# EAGLE design Stepper control circuit (EAGLE 7.6.0)
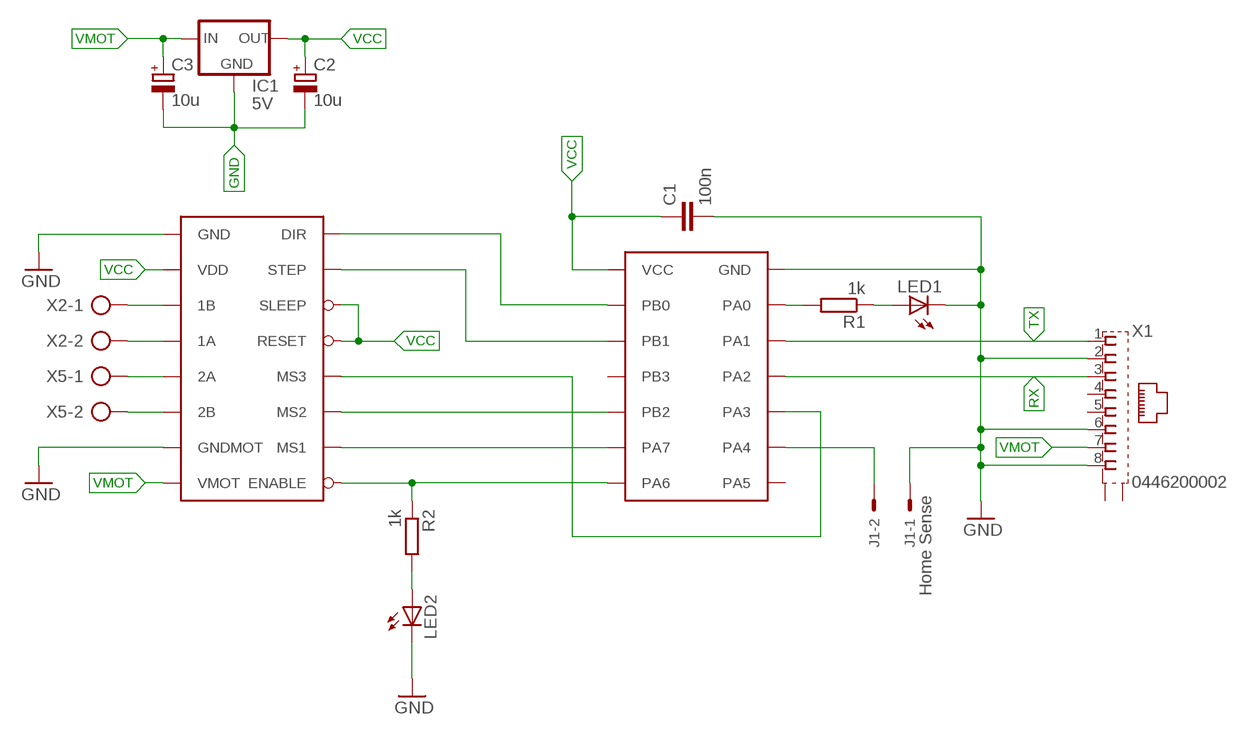
[diagram p0: schematic, sheet 1]

## Parts
C1  100n  C-EU050-025X075  [C050-025X075]
C2  10u  CPOL-EUE2.5-5  [E2,5-5]
C3  10u  CPOL-EUE2.5-5  [E2,5-5]
IC1  5V  VOL-REG-TO92  [TO92-CBE]
J1  Home Sense  22-27-2021-02  [6410-02]
LED1  LED3MM  [LED3MM]
LED2  LED3MM  [LED3MM]
R1  1k  R-EU_0204/2V  [0204V]
R2  1k  R-EU_0204/2V  [0204V]
U$1  ATTINY841-BOARD  [ADAPT-ATTINY841]
U$2  A4988-BOARD  [ADAPT-A4988]
X1  0446200002  [0446200002]
X2  AK500/2  [AK500/2]
X5  AK500/2  [AK500/2]

## Nets
DIR: U$1.PB0 U$2.DIR
ENABLE: R2.1 U$1.PA6 U$2.ENABLE
GND: C1.2 C2.- C3.- IC1.B(GND) J1.1 LED1.K(C) LED2.K(C) U$1.GND U$2.GND U$2.GNDMOT X1.2 X1.6 X1.8
MS1: U$1.PA7 U$2.MS1
MS2: U$1.PB2 U$2.MS2
MS3: U$1.PA3 U$2.MS3
N$1: J1.2 U$1.PA4
N$4: LED2.A R2.2
N$5: U$2.2B X5.2
N$6: U$2.2A X5.1
N$7: U$2.1A X2.2
N$8: R1.2 U$1.PA0
N$9: LED1.A R1.1
N$10: U$2.1B X2.1
RX: U$1.PA2 X1.3
STEP: U$1.PB1 U$2.STEP
TX: U$1.PA1 X1.1
VCC: C1.1 C2.+ IC1.C(OUT) U$1.VCC U$2.RESET U$2.SLEEP U$2.VDD
VMOT: C3.+ IC1.E(IN) U$2.VMOT X1.7
Unconnected: U$1.PA5 U$1.PB3 X1.4 X1.5 X1.S@1(S1) X1.S@2(S2)

## Library data of the parts
C1 = resistor:C-EU: CAPACITOR, European symbol
C2 C3 = resistor:CPOL-EU: POLARIZED CAPACITOR, European symbol
IC1 = LM78LXX-TO92-EBC:VOL-REG-TO92
J1 = con-molex:22-?-02: CONNECTOR wire to board 2.54 mm (.1 inch) pitch header; OC_FARNELL: unknown; OC_NEWARK: unknown
LED1 LED2 = led:LED: LED OSRAM: - CHIPLED LG R971, LG N971, LY N971, LG Q971, LY Q971, LO R971, LY R971 LH N974, LH R974 LS Q976, LO Q976, LY Q976 LO Q996 - Hyper CHIPLED LW Q18S LB Q993, LB Q99A, LB R99A - SideLED LS A670, LO A670, LY A670, LG A670, LP A670 LB A673, LV A673, LT A673, LW A673 LH A674 LY A675 LS A676, LA A676, LO A676, LY A676, LW A676 LS A679, LY A679, LG A679 - Hyper Micro SIDELED® LS Y876, LA Y876, LO Y876, LY Y876 LT Y87S - SmartLED LW L88C, LW L88S LB L89C, LB L89S, LG L890 LS L89K, LO L89K, LY L89K LS L896, LA L896, LO L896, LY L896 - TOPLED LS T670, LO T670, LY T670, LG T670, LP T670 LSG T670, LSP T670, LSY T670, LOP T670, LYG T670 LG T671, LOG T671, LSG T671 LB T673, LV T673, LT T673, LW T673 LH T674 LS T676, LA T676, LO T676, LY T676, LB T676, LH T676, LSB T676, LW T676 LB T67C, LV T67C, LT T67C, LS T67K, LO T67K, LY T67K, LW E67C LS E67B, LA E67B, LO E67B, LY E67B, LB E67C, LV E67C, LT E67C LW T67C LS T679, LY T679, LG T679 LS T770, LO T770, LY T770, LG T770, LP T770 LB T773, LV T773, LT T773, LW T773 LH T774 LS E675, LA E675, LY E675, LS T675 LS T776, LA T776, LO T776, LY T776, LB T776 LHGB T686 LT T68C, LB T68C - Hyper Mini TOPLED® LB M676 - Mini TOPLED Santana® LG M470 LS M47K, LO M47K, LY M47K Source: http://www.osram.convergy.de LUXEON: - LUMILED® LXK2-PW12-R00, LXK2-PW12-S00, LXK2-PW14-U00, LXK2-PW14-V00 LXK2-PM12-R00, LXK2-PM12-S00, LXK2-PM14-U00 LXK2-PE12-Q00, LXK2-PE12-R00, LXK2-PE12-S00, LXK2-PE14-T00, LXK2-PE14-U00 LXK2-PB12-K00, LXK2-PB12-L00, LXK2-PB12-M00, LXK2-PB14-N00, LXK2-PB14-P00, LXK2-PB14-Q00 LXK2-PR12-L00, LXK2-PR12-M00, LXK2-PR14-Q00, LXK2-PR14-R00 LXK2-PD12-Q00, LXK2-PD12-R00, LXK2-PD12-S00 LXK2-PH12-R00, LXK2-PH12-S00 LXK2-PL12-P00, LXK2-PL12-Q00, LXK2-PL12-R00 Source: www.luxeon.com KINGBRIGHT: KA-3528ASYC Source: www.kingbright.com
R1 R2 = resistor:R-EU_: RESISTOR, European symbol
U$1 = adapterboards:ATTINY841-BOARD: Adapterplatine fuer Mikrocontroller Attiny841
U$2 = adapterboards:A4988-BOARD: Adapterplatine fuer den Schrittmotor Controller A4988
X1 = con-molex:0446200002: RJ-45 INVERTED MODULAR JACK ASSEMBLY WITH RJ-11 KEEPOUT FEATURE Source: Data sheet <http://www.farnell.com/datasheets/73207.pdf> MOLEX 0446200002 BUCHSE, RJ45, GESCHIRMT Source: Farnell <http://de.farnell.com/molex/0446200002/buchse-rj45-geschirmt/dp/9251910?ost=9251910>; MF: MOLEX; MPN: 0446200002; OC_FARNELL: 9251910
X2 X5 = con-ptr500:AK500/2: CONNECTOR; OC_FARNELL: unknown; OC_NEWARK: unknown

## Board
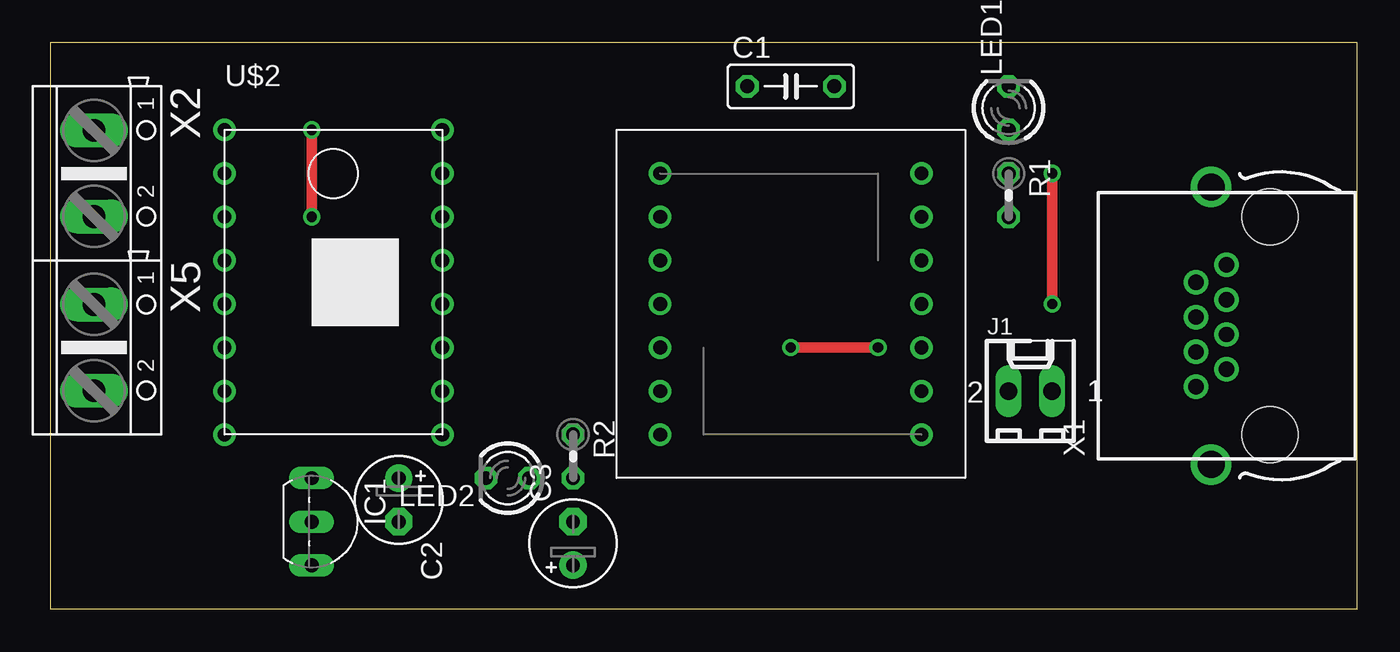
[diagram p1: board, top side]
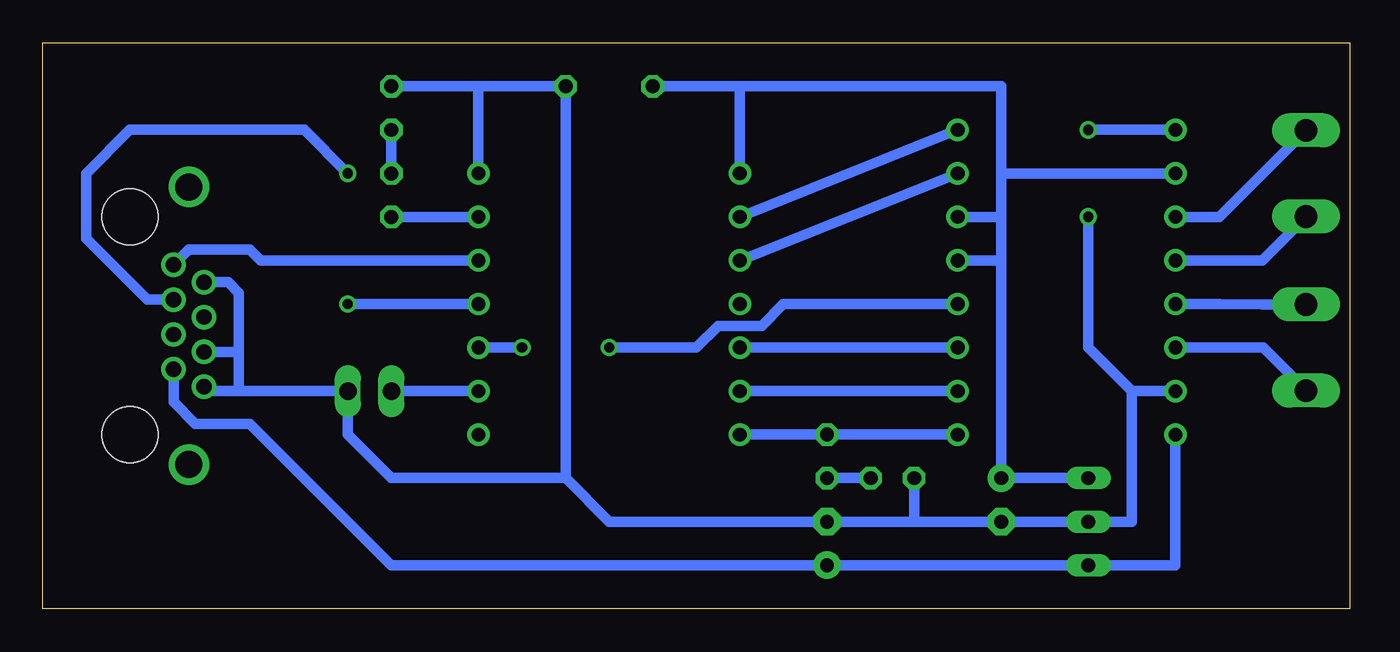
[diagram p2: board, bottom side, seen from below]

Size 76.2 x 33.02 mm. Coordinates in mm from the lower left corner, seen from the top.
Outline: 0,0 76.2,0 76.2,33.02 0,33.02 0,0
Copper layers (1*16): Top 0.035mm / dielectric 1.5mm / Bottom 0.035mm
Design rules "default": minimum track width 10mil, minimum drill 24mil, track to track 8mil, track to pad 8mil, pad to pad 8mil, via to via 8mil, smd to smd 8mil, copper to edge 40mil, drill to drill 8mil, minimum pad ring 10mil, minimum via ring 8mil, stop-mask expansion 4mil, vias tented up to drill 0mil, thermal gap 10mil

### Footprints (pad centres in the part's own frame; a part is rotated, then mirrored left to right if it is on the bottom)
C050-025X075 = drill 0.813 octagon: 1 -2.54,0; 2 2.54,0
E2,5-5 = drill 0.813 pad 1.6: + -1.27,0 | drill 0.813 pad 1.6 octagon: - 1.27,0
TO92-CBE = drill 0.813 long: B 0,0; C -2.54,0; E 2.54,0
6410-02 = drill 1.016 long: 1 1.27,0; 2 -1.27,0
LED3MM = drill 0.813 octagon: A -1.27,0; K 1.27,0
0204V = drill 0.813 octagon: 1 -1.27,0; 2 1.27,0
ADAPT-ATTINY841 = drill 0.8: GND 15.24,0; PA0 15.24,-2.54; PA1 15.24,-5.08; PA2 15.24,-7.62; PA3 15.24,-10.16; PA4 15.24,-12.7; PA5 15.24,-15.24; PA6 0,-15.24; PA7 0,-12.7; PB0 0,-2.54; PB1 0,-5.08; PB2 0,-10.16; PB3 0,-7.62; VCC 0,0
ADAPT-A4988 = drill 0.8: 1A 0,-7.62; 1B 0,-5.08; 2A 0,-10.16; 2B 0,-12.7; DIR 12.7,0; ENABLE 12.7,-17.78; GND 0,0; GNDMOT 0,-15.24; MS1 12.7,-15.24; MS2 12.7,-12.7; MS3 12.7,-10.16; RESET 12.7,-7.62; SLEEP 12.7,-5.08; STEP 12.7,-2.54; VDD 0,-2.54; VMOT 0,-17.78
0446200002 = drill 0.889 pad 1.422: 1 3.556,2.54; 2 2.54,4.318; 3 1.524,2.54; 4 0.508,4.318; 5 -0.508,2.54; 6 -1.524,4.318; 7 -2.54,2.54; 8 -3.556,4.318 | drill 1.575 pad 2.286: S@1 -8.103,3.429; S@2 8.103,3.429 | hole 3.251: 6.35,0; -6.35,0
AK500/2 = drill 1.321 long: 1 -2.515,0; 2 2.515,0

### Placement (x,y rotation side)
C1  43.18,30.48 0 top
C2  20.32,6.35 270 top
C3  30.48,3.81 90 top
IC1  15.24,5.08 270 top
J1  57.15,12.7 0 top
LED1  55.88,29.21 90 top
LED2  26.67,7.62 180 top
R1  55.88,24.13 270 top
R2  30.48,8.89 270 top
U$1  35.56,25.4 0 top
U$2  10.16,27.94 0 top
X1  71.12,16.51 90 top
X2  2.54,25.4 270 top
X5  2.54,15.24 270 top

### Tracks (layer width: path | path; a pad name or v marks a point on that pad's centre or on a via)
DIR
  Bottom 0.61: U$1.PB0 U$2.DIR
ENABLE
  Bottom 0.61: U$2.ENABLE R2.1 U$1.PA6
GND  (via drill 0.6)
  Top 0.61: v15.24,27.94 v15.24,22.86
  Bottom 0.61: 50.8,30.48 U$1.GND | LED1.K 50.8,30.48 | U$2.GNDMOT 12.7,12.7 | v15.24,22.86 15.24,15.24 12.7,12.7 | 50.8,30.48 C1.2 45.72,7.62 | U$2.GND v15.24,27.94 | 45.72,7.62 55.88,7.62 58.42,10.16 J1.1 64.77,12.7 | X1.2 65.41,19.05 64.77,18.41 64.77,14.99 | 25.4,5.08 C2.- IC1.B 12.7,5.08 12.7,12.7 | 25.4,5.08 C3.- 43.18,5.08 45.72,7.62 | LED2.K 25.4,5.08 | 64.77,12.7 66.55,12.7 X1.8 | X1.6 64.77,14.99 | 64.77,14.99 64.77,12.7
MS1
  Bottom 0.61: U$2.MS1 U$1.PA7
MS2
  Bottom 0.61: U$2.MS2 U$1.PB2
MS3  (via drill 0.6)
  Top 0.61: v43.18,15.24 v48.26,15.24
  Bottom 0.61: U$2.MS3 33.02,17.78 34.29,16.51 36.83,16.51 38.1,15.24 v43.18,15.24 | v48.26,15.24 U$1.PA3
N$1
  Bottom 0.61: U$1.PA4 J1.2
N$4
  Bottom 0.61: R2.2 LED2.A
N$5
  Bottom 0.61: X5.2 5.05,15.24 U$2.2B
N$6
  Bottom 0.61: X5.1 5.08,17.75 7.62,17.78 U$2.2A
N$7
  Bottom 0.61: X2.2 5.11,20.32 U$2.1A
N$8
  Bottom 0.61: U$1.PA0 R1.2
N$9
  Bottom 0.61: R1.1 LED1.A
N$10
  Bottom 0.61: X2.1 7.59,22.86 U$2.1B
RX  (via drill 0.6)
  Top 0.61: v58.42,17.78 v58.42,25.4
  Bottom 0.61: U$1.PA2 v58.42,17.78 | X1.3 70.1,18.03 73.66,21.59 73.66,25.4 71.12,27.94 60.96,27.94 v58.42,25.4
STEP
  Bottom 0.61: U$1.PB1 U$2.STEP
TX
  Bottom 0.61: U$1.PA1 63.5,20.32 64.14,20.95 67.69,20.95 X1.1
VCC
  Bottom 0.61: U$2.RESET 20.32,20.32 | 20.32,20.32 20.32,22.86 | 20.32,22.86 U$2.SLEEP | 20.32,22.86 20.32,25.4 | 20.32,25.4 20.32,30.48 35.56,30.48 | U$2.VDD 20.32,25.4 | C1.1 35.56,30.48 | 35.56,30.48 U$1.VCC | IC1.C C2.+ 20.32,20.32
VMOT
  Bottom 0.61: X1.7 68.58,12.06 67.31,10.79 64.14,10.79 55.88,2.54 C3.+ IC1.E 10.16,2.54 U$2.VMOT